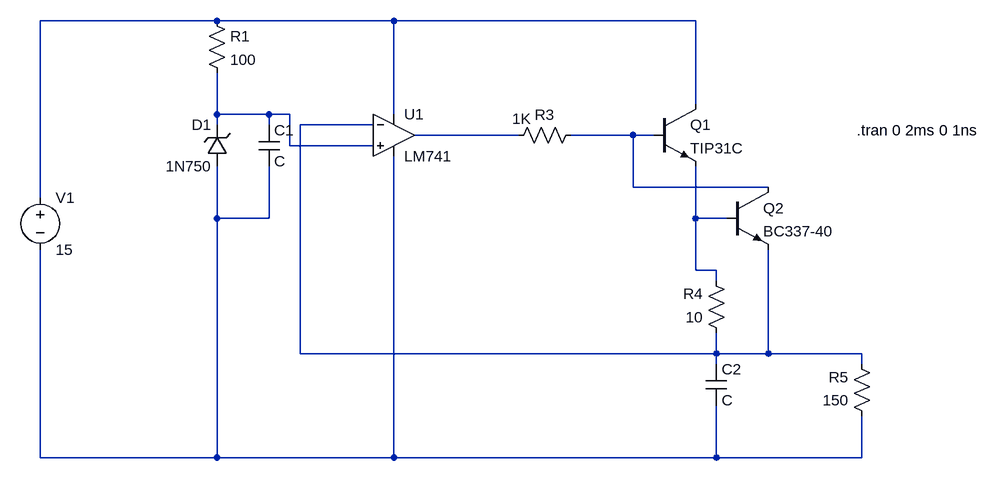
[diagram p0: schematic Draft7.asc]
Draft7.asc, the LTspice schematic file:
Version 4
SHEET 1 1068 728
WIRE -112 48 -384 48
WIRE 160 48 -112 48
WIRE 624 48 160 48
WIRE 624 176 624 48
WIRE -112 192 -112 128
WIRE -32 192 -112 192
WIRE 0 192 -32 192
WIRE 160 192 160 48
WIRE -112 208 -112 192
WIRE -32 208 -32 192
WIRE 128 208 16 208
WIRE 352 224 192 224
WIRE 528 224 432 224
WIRE 560 224 528 224
WIRE 0 240 0 192
WIRE 128 240 0 240
WIRE 528 304 528 224
WIRE 736 304 528 304
WIRE -384 320 -384 48
WIRE -112 352 -112 272
WIRE -32 352 -32 272
WIRE -32 352 -112 352
WIRE 624 352 624 272
WIRE 672 352 624 352
WIRE 624 432 624 352
WIRE 656 432 624 432
WIRE 656 448 656 432
WIRE 16 560 16 208
WIRE 656 560 656 528
WIRE 656 560 16 560
WIRE 736 560 736 400
WIRE 736 560 656 560
WIRE 880 560 736 560
WIRE 656 576 656 560
WIRE 880 576 880 560
WIRE -384 720 -384 400
WIRE -112 720 -112 352
WIRE -112 720 -384 720
WIRE 160 720 160 256
WIRE 160 720 -112 720
WIRE 656 720 656 640
WIRE 656 720 160 720
WIRE 880 720 880 656
WIRE 880 720 656 720
SYMBOL res -128 32 R0
SYMATTR InstName R1
SYMATTR Value 100
SYMBOL res 448 208 R90
WINDOW 0 0 56 VBottom 2
WINDOW 3 -25 91 VTop 2
SYMATTR InstName R3
SYMATTR Value 1K
SYMBOL res 672 544 R180
WINDOW 0 36 76 Left 2
WINDOW 3 36 40 Left 2
SYMATTR InstName R4
SYMATTR Value 10
SYMBOL res 896 672 R180
WINDOW 0 36 76 Left 2
WINDOW 3 36 40 Left 2
SYMATTR InstName R5
SYMATTR Value 150
SYMBOL Opamps/opamp2 160 160 R0
SYMATTR InstName U1
SYMATTR Value LM741
SYMBOL zener -96 272 R180
WINDOW 0 24 64 Left 2
WINDOW 3 24 0 Left 2
SYMATTR InstName D1
SYMATTR Value 1N750
SYMBOL npn 560 176 R0
SYMATTR InstName Q1
SYMATTR Value TIP31C
SYMBOL cap -48 208 R0
SYMATTR InstName C1
SYMBOL cap 640 576 R0
SYMATTR InstName C2
SYMBOL npn 672 304 R0
SYMATTR InstName Q2
SYMATTR Value BC337-40
SYMBOL voltage -384 304 R0
SYMATTR InstName V1
SYMATTR Value 15
TEXT 872 216 Left 2 !.tran 0 2ms 0 1ns

The netlist it stands for:
* Draft7.asc
R1 N001 N002 100
R3 N005 N004 1K
R4 N003 N007 10
R5 N006 N003 150
XU1 N002 N003 N001 N006 N004 LM741  ; pins In+ In- V+ V- OUT
D1 N006 N002 1N750
Q1 N001 N005 N007 0 TIP31C
C1 N002 N006 C
C2 N003 N006 C
Q2 N005 N007 N003 0 BC337-40
V1 N001 N006 15
.model D D
.lib standard.dio
.model NPN NPN
.model PNP PNP
.lib standard.bjt
.tran 0 2ms 0 1ns
.backanno
.end